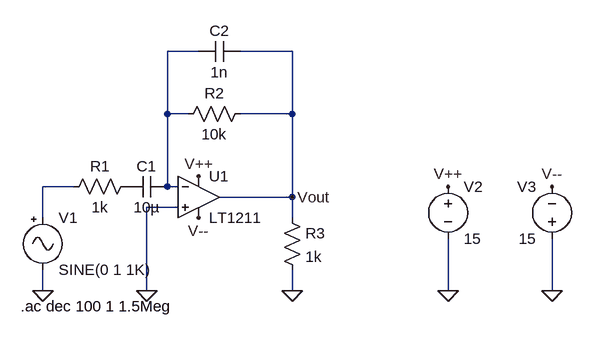
[diagram p0: schematic Draft1.asc]
Draft1.asc, the LTspice schematic file:
Version 4
SHEET 1 880 680
WIRE 256 -48 208 -48
WIRE 400 -48 320 -48
WIRE 208 48 208 -48
WIRE 240 48 208 48
WIRE 400 48 400 -48
WIRE 400 48 320 48
WIRE 64 160 16 160
WIRE 208 160 208 48
WIRE 224 160 208 160
WIRE 400 176 400 48
WIRE 400 176 288 176
WIRE 224 192 176 192
WIRE 16 208 16 160
WIRE 400 208 400 176
WIRE 16 320 16 288
WIRE 176 320 176 192
WIRE 400 320 400 288
WIRE 640 320 640 240
WIRE 800 320 800 240
FLAG 16 320 0
FLAG 176 320 0
FLAG 400 320 0
FLAG 640 320 0
FLAG 800 320 0
FLAG 640 160 V++
FLAG 800 160 V--
FLAG 256 144 V++
FLAG 256 208 V--
FLAG 400 176 Vout
SYMBOL Opamps\\LT1211 256 112 R0
SYMATTR InstName U1
SYMBOL res 160 144 R90
WINDOW 0 0 56 VBottom 2
WINDOW 3 32 56 VTop 2
SYMATTR InstName R1
SYMATTR Value 1k
SYMBOL res 336 32 R90
WINDOW 0 0 56 VBottom 2
WINDOW 3 32 56 VTop 2
SYMATTR InstName R2
SYMATTR Value 10k
SYMBOL res 384 192 R0
SYMATTR InstName R3
SYMATTR Value 1k
SYMBOL cap 208 144 R90
WINDOW 0 0 32 VBottom 2
WINDOW 3 32 32 VTop 2
SYMATTR InstName C1
SYMATTR Value 10µ
SYMBOL Misc\\signal 16 192 R0
WINDOW 39 0 0 Left 0
SYMATTR InstName V1
SYMATTR Value2 AC 1
SYMBOL voltage 640 144 R0
WINDOW 123 0 0 Left 0
WINDOW 39 0 0 Left 0
SYMATTR InstName V2
SYMATTR Value 15
SYMBOL voltage 800 256 R180
WINDOW 0 24 96 Left 2
WINDOW 3 24 16 Left 2
WINDOW 123 0 0 Left 0
WINDOW 39 0 0 Left 0
SYMATTR InstName V3
SYMATTR Value 15
SYMBOL cap 320 -64 R90
WINDOW 0 0 32 VBottom 2
WINDOW 3 32 32 VTop 2
SYMATTR InstName C2
SYMATTR Value 1n
TEXT -18 344 Left 2 !.ac dec 100 1 1.5Meg

The netlist it stands for:
* Draft1.asc
XU1 0 N001 V++ V-- Vout LT1211  ; pins In+ In- V+ V- OUT
R1 P001 N002 1k
R2 Vout N001 10k
R3 Vout 0 1k
C1 N001 P001 10µ
V1 N002 0 SINE(0 1 1K) AC 1
V2 V++ 0 15
V3 0 V-- 15
C2 Vout N001 1n
.ac dec 100 1 1.5Meg
.lib LTC.lib
.backanno
.end